# EAGLE design Power control shield v1 (EAGLE 6.1)
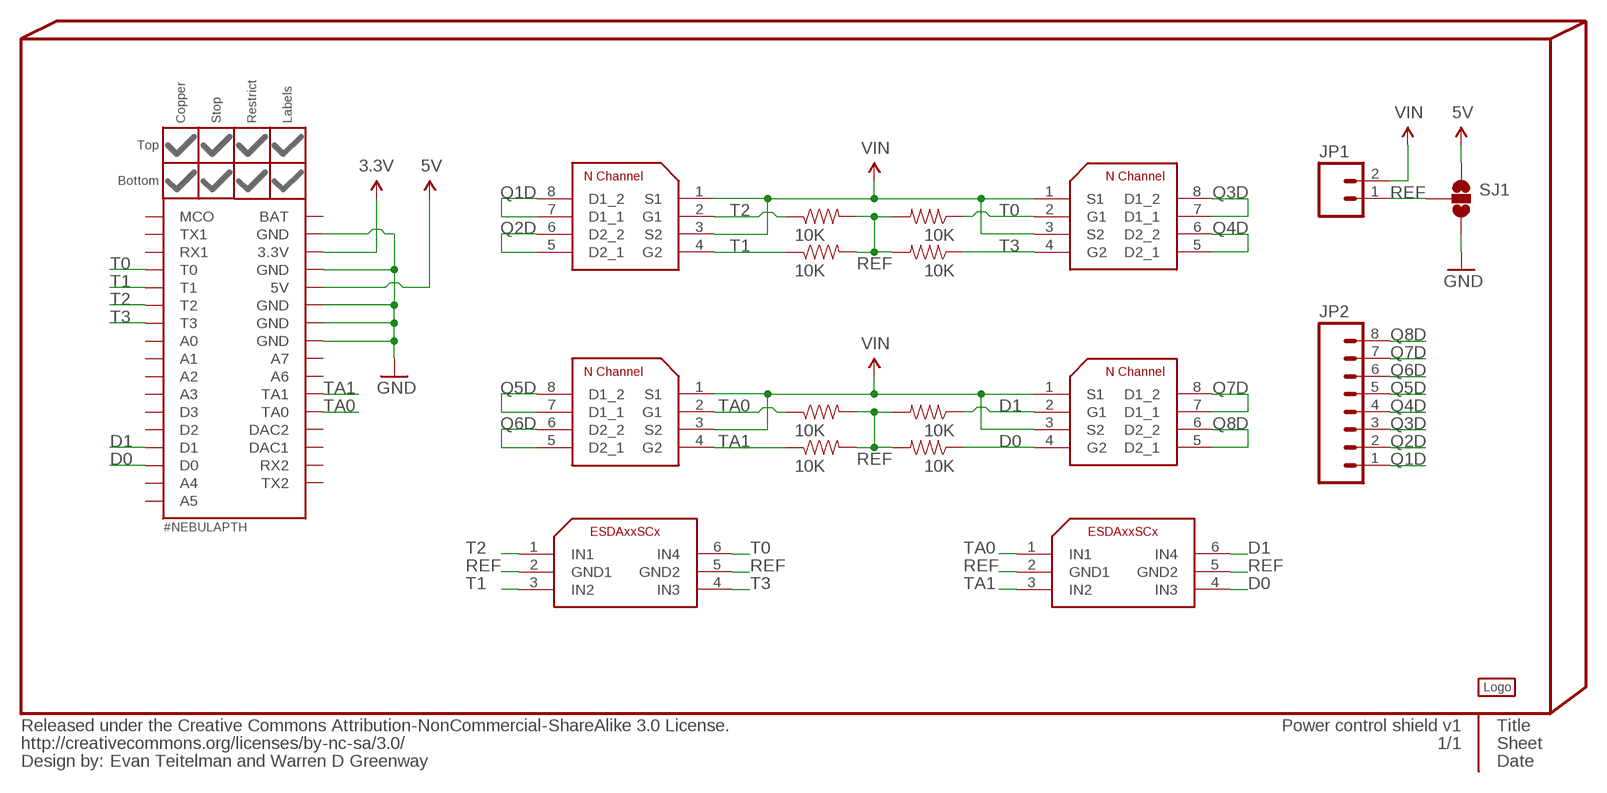
[diagram p0: schematic, sheet 1]

## Parts
INFO2  Evan Teitelman and Warren D Greenway  %CC-NC-SA  [%CC-NC-SA]
JP1  M02PTH  [1X02]
JP2  M081X08  [1X08]
LOGO1  #LOGOA-THICK  [#LOGOA-THICK]
NEBULA1  #NEBULAPTH  [#NEBULA-PTH]
NEBULAPART1  #NEBULA-PARTLABELS-BOTTOM  [#NEBULA-LABELS-BOTT]
R1  10K  RESISTOR0402-RES  [0402-RES]
R2  10K  RESISTOR0402-RES  [0402-RES]
R3  10K  RESISTOR0402-RES  [0402-RES]
R4  10K  RESISTOR0402-RES  [0402-RES]
R9  10K  RESISTOR0402-RES  [0402-RES]
R10  10K  RESISTOR0402-RES  [0402-RES]
R11  10K  RESISTOR0402-RES  [0402-RES]
R12  10K  RESISTOR0402-RES  [0402-RES]
SJ1  SOLDERJUMPER_2WAYPASTE2&3  [SJ_3_PASTE2&3]
U1  TRANSISTOR-VISHAY-SI7288DP  [SOIC8]
U2  TRANSISTOR-VISHAY-SI7288DP  [SOIC8]
U3  TRANSISTOR-VISHAY-SI7288DP  [SOIC8]
U4  TRANSISTOR-VISHAY-SI7288DP  [SOIC8]
U$1  ESDAXXSC6  [SOT23-6L]
U$3  ESDAXXSC6  [SOT23-6L]

## Nets
3.3V: NEBULA1.3.3V ; supply symbol labelled @3.3V
5V: NEBULA1.5V SJ1.1 ; supply symbol labelled @5V
D0: NEBULA1.D0 R4.1 U4.4(G2) U$3.4(IN3)
D1: NEBULA1.D1 R3.1 U4.2(G1) U$3.6(IN4)
GND: NEBULA1.GND1(GND) NEBULA1.GND2(GND) NEBULA1.GND3(GND) NEBULA1.GND4(GND) NEBULA1.GND5(GND) SJ1.3 ; supply symbol labelled @GND
Q1D: JP2.1 U1.7(D1_1) U1.8(D1_2)
Q2D: JP2.2 U1.5(D2_1) U1.6(D2_2)
Q3D: JP2.3 U2.7(D1_1) U2.8(D1_2)
Q4D: JP2.4 U2.5(D2_1) U2.6(D2_2)
Q5D: JP2.5 U3.7(D1_1) U3.8(D1_2)
Q6D: JP2.6 U3.5(D2_1) U3.6(D2_2)
Q7D: JP2.7 U4.7(D1_1) U4.8(D1_2)
Q8D: JP2.8 U4.5(D2_1) U4.6(D2_2)
REF: JP1.1 R1.2 R2.2 R3.2 R4.2 R9.2 R10.2 R11.2 R12.2 SJ1.2 U$1.2(GND1) U$1.5(GND2) U$3.2(GND1) U$3.5(GND2)
T0: NEBULA1.T0 R11.1 U2.2(G1) U$1.6(IN4)
T1: NEBULA1.T1 R10.1 U1.4(G2) U$1.3(IN2)
T2: NEBULA1.T2 R9.1 U1.2(G1) U$1.1(IN1)
T3: NEBULA1.T3 R12.1 U2.4(G2) U$1.4(IN3)
TA0: NEBULA1.TA0 R1.1 U3.2(G1) U$3.1(IN1)
TA1: NEBULA1.TA1 R2.1 U3.4(G2) U$3.3(IN2)
VIN: JP1.2 U1.1(S1) U1.3(S2) U2.1(S1) U2.3(S2) U3.1(S1) U3.3(S2) U4.1(S1) U4.3(S2) ; supply symbol labelled @VIN
Unconnected: NEBULA1.A0 NEBULA1.A1 NEBULA1.A2 NEBULA1.A3 NEBULA1.A4 NEBULA1.A5 NEBULA1.A6 NEBULA1.A7 NEBULA1.BAT NEBULA1.COM1_RX(RX1) NEBULA1.COM1_TX(TX1) NEBULA1.COM2_RX(RX2) NEBULA1.COM2_TX(TX2) NEBULA1.D2 NEBULA1.D3 NEBULA1.DAC1 NEBULA1.DAC2 NEBULA1.MCO

## Library data of the parts
INFO2 = PygmyBoards:%CC-NC-SA: Released under the Creative Commons Attribution-NonCommercial-ShareAlike 3.0 License. http://creativecommons.org/licenses/by-sa/3.0 Design by: [Designer Name] Change this part's value to change the designer name
JP1 = SparkFun:M02: Header 2 Standard 2-pin 0.1" header. Use with straight break away headers (SKU : PRT-00116), right angle break away headers (PRT-00553), swiss pins (PRT-00743), machine pins (PRT-00117), and female headers (PRT-00115). Molex polarized connector foot print use with SKU : PRT-08233 with associated crimp pins and housings.
JP2 = SparkFun:M08: Header 8 Standard 8-pin 0.1" header. Use with straight break away headers (SKU : PRT-00116), right angle break away headers (PRT-00553), swiss pins (PRT-00743), machine pins (PRT-00117), and female headers (PRT-00115).
LOGO1 = PygmyBoards:#LOGO
NEBULA1 = PygmyBoards:#NEBULA: Nebula Board and Shield Footprint Pads This is the only absolutely required part for the footprint. The parts in "#NEBULA-PART" are merely aesthetic. A circular board outline should be .001" thick and 1.005" in diameter (Reference circle on the Document (48) layer provided).
NEBULAPART1 = PygmyBoards:#NEBULA-PART: Nebula Board and Shield Footprint Parts These parts are only functional when combined with the pads in "#NEBULA".
R1-R4 R9-R12 = SparkFun:RESISTOR: Resistor Basic schematic elements and footprints for 0603, 1206, and PTH resistors.
SJ1 = SparkFun:SOLDERJUMPER_2WAY: Solder Jumper 2 way solder jumper
U1-U4 = Pygmy:TRANSISTOR-VISHAY-SI7288DP
U$1 U$3 = Pygmy:ESDAXXSC6

## Board
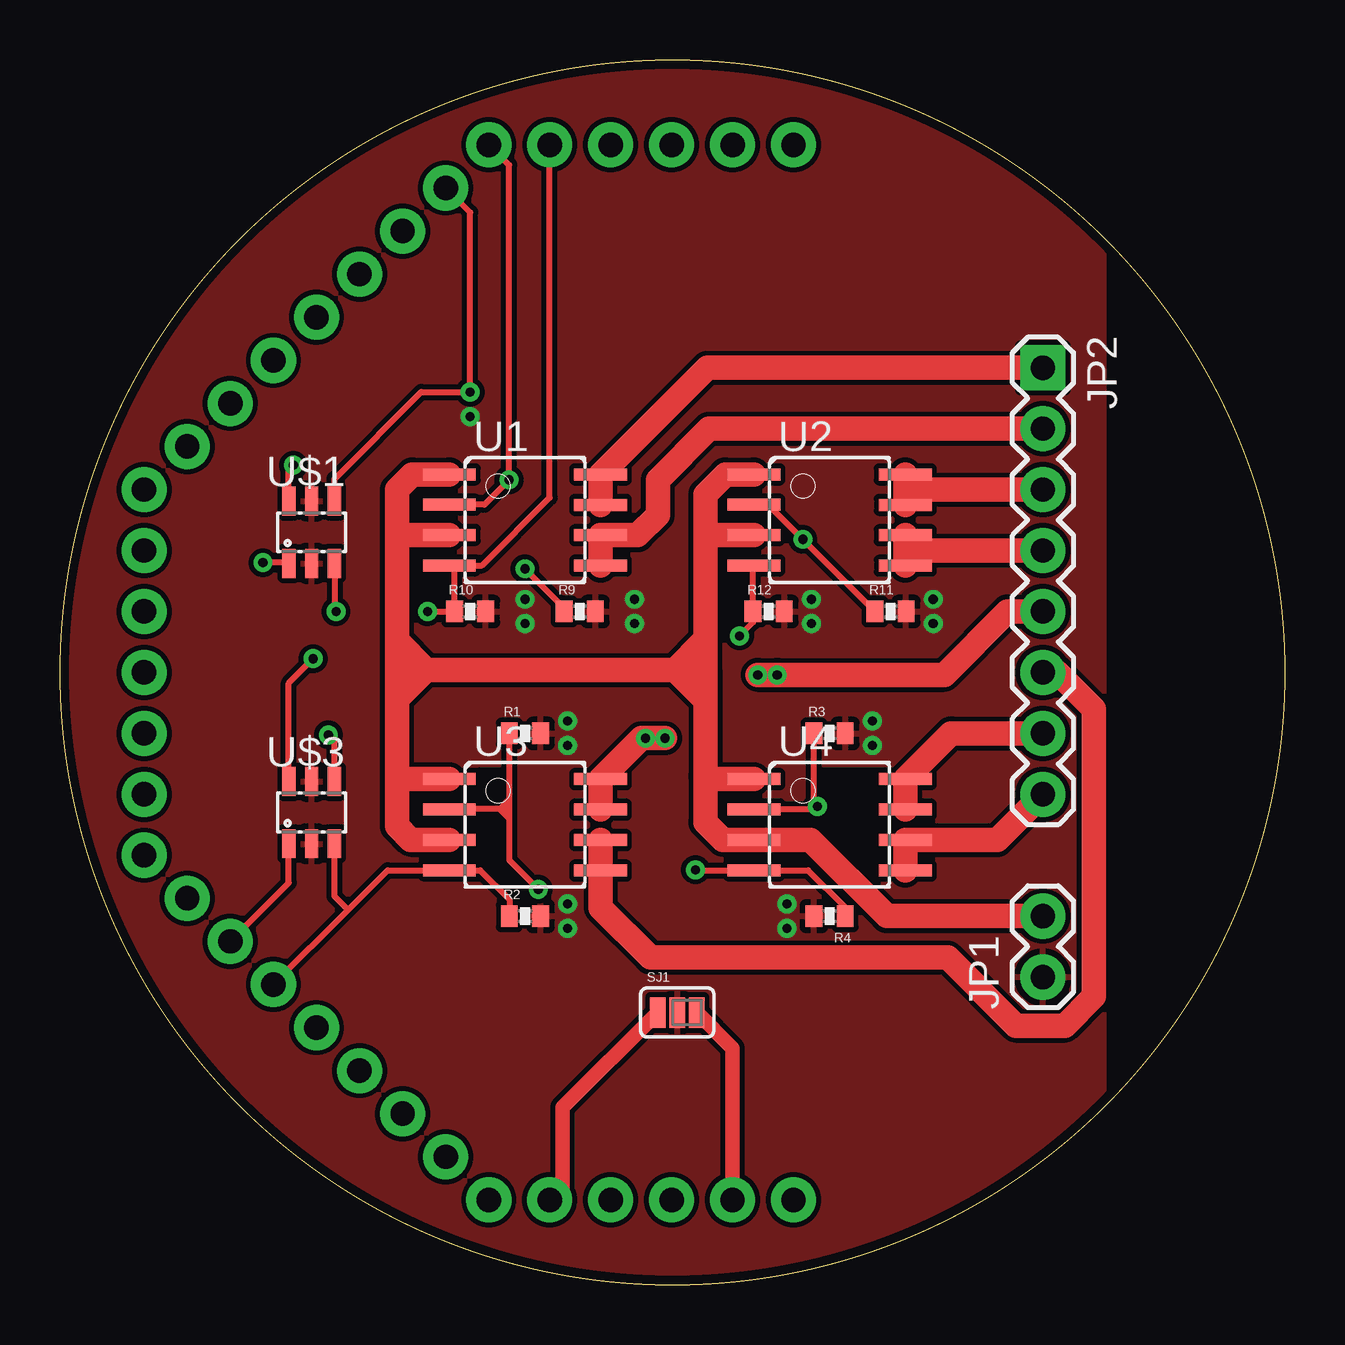
[diagram p1: board, top side]
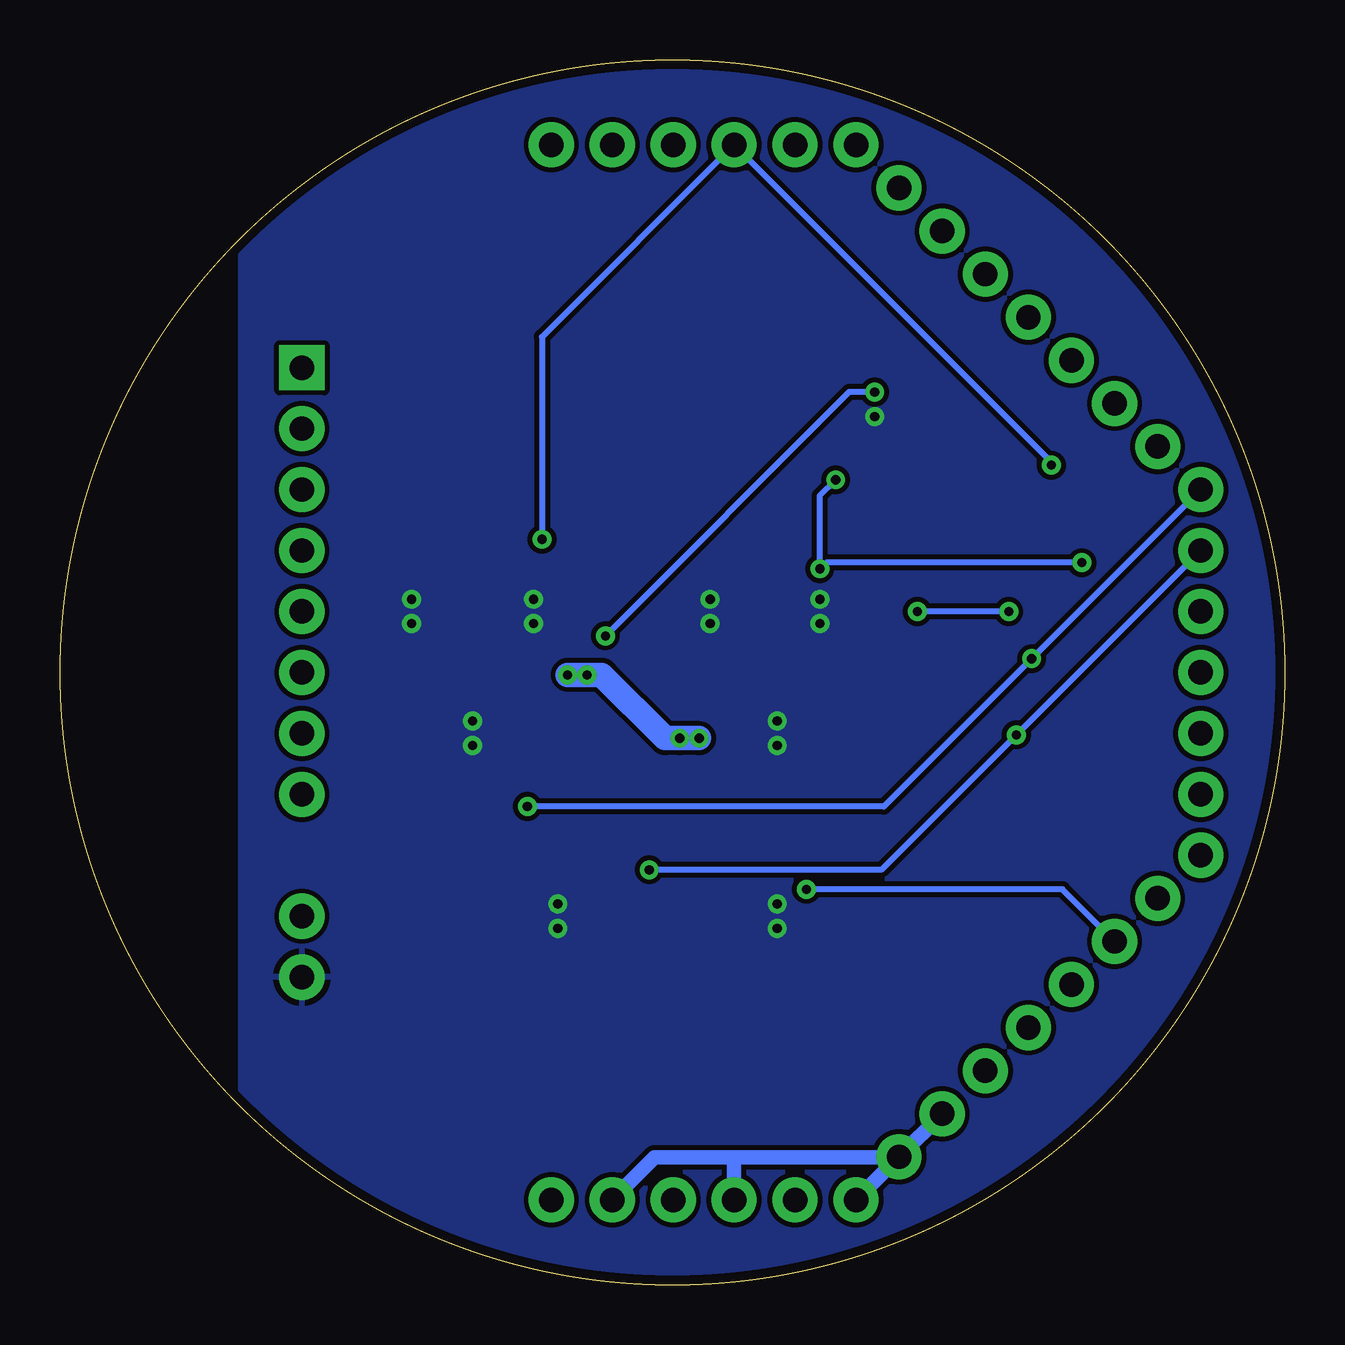
[diagram p2: board, bottom side, seen from below]

Size 51.05 x 51.05 mm. Coordinates in mm from the lower left corner, seen from the top.
Outline: circle at 25.53,25.53 radius 25.53
Copper layers (1*16): Top 0.035mm / dielectric 1.5mm / Bottom 0.035mm
Design rules: minimum track width 6mil, minimum drill 15mil, track to track 6mil, track to pad 6mil, pad to pad 4mil, via to via 6mil, smd to smd 4mil, copper to edge 15mil, drill to drill 6mil, minimum pad ring 10mil, minimum via ring 8mil, stop-mask expansion 4mil, vias tented up to drill 25mil, thermal gap 10mil
tRestrict: 2 lines

### Footprints (pad centres in the part's own frame; a part is rotated, then mirrored left to right if it is on the bottom)
1X02 = drill 1.016 pad 1.88: 1 0,0; 2 2.54,0
1X08 = drill 1.016 pad 1.88 square: 1 0,0 | drill 1.016 pad 1.88: 2 2.54,0; 3 5.08,0; 4 7.62,0; 5 10.16,0; 6 12.7,0; 7 15.24,0; 8 17.78,0
#NEBULA-PTH = drill 1.016 pad 1.88: 3.3V -25.637,-47.388; 5V -30.716,-47.388; A0 -36.848,-7.004; A1 -38.645,-8.8; A2 -40.44,-10.596; A3 -42.237,-12.392; A4 -47.625,-22.86; A5 -47.625,-25.4; A6 -40.44,-40.204; A7 -38.645,-42; BAT -20.557,-47.388; COM1_RX -25.636,-3.412; COM1_TX -23.096,-3.412; COM2_RX -47.625,-30.48; COM2_TX -47.625,-27.94; D0 -47.625,-20.32; D1 -47.625,-17.78; D2 -45.829,-15.984; D3 -44.032,-14.188; DAC1 -47.625,-33.02; DAC2 -45.829,-34.816; GND1 -36.848,-43.796; GND2 -35.052,-45.592; GND3 -33.256,-47.388; GND4 -28.177,-47.388; GND5 -23.097,-47.388; MCO -20.556,-3.412; T0 -28.176,-3.412; T1 -30.716,-3.412; T2 -33.256,-3.412; T3 -35.052,-5.208; TA0 -44.032,-36.612; TA1 -42.237,-38.408
0402-RES = smd 0.7 x 0.9: 1 -0.65,0; 2 0.65,0
SJ_3_PASTE2&3 = smd 0.635 x 1.27: 1 -0.813,0; 2 0,0; 3 0.813,0
SOIC8 = smd 0.5 x 2.2: 1 -1.905,-3.154; 2 -0.645,-3.154; 3 0.625,-3.154; 4 1.895,-3.154; 5 1.905,3.154; 6 0.635,3.154; 7 -0.635,3.154; 8 -1.905,3.154
SOT23-6L = smd 0.55 x 1.2: 1 -0.95,-1.3; 2 0,-1.3; 3 0.95,-1.3; 4 0.95,1.3; 5 0,1.3; 6 -0.95,1.3

### Placement (x,y rotation side)
INFO2  51.13,50.93 0 top
JP1  40.97,12.83 90 top
JP2  40.97,38.23 270 top
LOGO1  25.73,36.96 90 bottom
NEBULA1  51.13,50.93 0 top
NEBULAPART1  51.13,50.93 0 top
R1  19.38,22.99 0 top
R2  19.38,15.37 0 top
R3  32.08,22.99 0 top
R4  32.08,15.37 180 top
R9  21.67,28.07 0 top
R10  17.09,28.07 0 top
R11  34.62,28.07 0 top
R12  29.54,28.07 0 top
SJ1  25.73,11.35 0 top
U1  19.38,31.88 270 top
U2  32.08,31.88 270 top
U3  19.38,19.18 270 top
U4  32.08,19.18 270 top
U$1  10.49,31.37 0 top
U$3  10.49,19.68 0 top

### Tracks (layer width: path | path; a pad name or v marks a point on that pad's centre or on a via)
5V
  Top 0.61: SJ1.1 20.96,7.39 20.96,4.08 NEBULA1.5V
D0  (via drill 0.38)
  Top 0.254: v26.49,17.3 26.51,17.28 U4.4 31.18,17.28 32.73,15.73 R4.1 | U$3.4 11.44,22.67 v11.19,22.92
  Bottom 0.254: v26.49,17.3 16.82,17.3 v11.19,22.92 NEBULA1.D0
D1  (via drill 0.38)
  Top 0.254: 30.03,19.82 U4.2 31.46,19.82 v31.57,19.94 31.43,20.08 R3.1 | U$3.6 9.54,25.09 v10.55,26.1
  Bottom 0.254: v31.57,19.94 16.71,19.94 v10.55,26.1 NEBULA1.D1
GND
  Top 0.61: SJ1.3 28.03,9.86 NEBULA1.GND5
  Bottom 0.61: NEBULA1.GND1 | NEBULA1.GND2 NEBULA1.GND1 | NEBULA1.GND2 | NEBULA1.GND3 NEBULA1.GND2 | NEBULA1.GND5 26.26,5.31 22.78,5.31 | 22.78,5.31 16.1,5.31 NEBULA1.GND2 | NEBULA1.GND4 22.95,5.14 22.78,5.31
Q1D
  Top 1.016: U1.7 U1.8 26.98,38.23 JP2.1
Q2D
  Top 1.016: U1.5 U1.6 24.08,31.24 24.92,32.08 24.92,33.55 27.05,35.69 JP2.2
Q3D
  Top 1.016: U2.7 35.23,33.15 | 35.23,33.15 U2.8 | 35.23,33.15 JP2.3
Q4D
  Top 0.61: 35.23,30.71 35.34,30.61
  Top 1.016: U2.5 35.23,30.71 U2.6 | 35.34,30.61 JP2.4
Q5D  (via drill 0.38)
  Top 0.61: 24.24,22.78 v24.41,22.78
  Top 1.016: U3.7 U3.8 24.24,22.78 | JP2.5 39.5,28.07 36.86,25.43 v29.9,25.43 v29.08,25.43 | v24.41,22.78 v25.22,22.78
  Bottom 1.016: v29.9,25.43 v29.08,25.43 28.47,25.43 25.83,22.78 v25.22,22.78 v24.41,22.78
Q6D
  Top 0.61: U3.5 U3.6
  Top 1.016: U3.6 22.53,15.72 24.61,13.64 37.01,13.64 39.85,10.79 41.88,10.79 43.1,12.01 43.1,24 41.58,25.53 JP2.6
Q7D
  Top 1.016: U4.7 U4.8 37.14,22.99 JP2.7
Q8D
  Top 1.016: U4.5 U4.6 39.07,18.54 JP2.8
REF  (via drill 0.38)
  other vias: 23.95,28.57 19.38,28.57 19.38,27.56 23.95,27.56 21.16,23.5 21.16,22.48 21.16,15.88 21.16,14.86 30.3,15.88 30.3,14.86 33.86,23.5 33.86,22.48 31.32,28.57 31.32,27.56 36.4,28.57 36.4,27.56 17.09,36.19
  pour Top (isolate 0.203): -0.94,-1.14 43.51,-1.14 43.51,52.2 -0.94,52.2
  pour Bottom (isolate 0.203): -2.21,-2.41 43.51,-2.41 43.51,53.47 -2.21,53.47
T0  (via drill 0.38)
  Top 0.254: U2.2 29.5,32.54 v30.96,31.07 R11.1 | U$1.6 9.54,33.97 v9.73,34.16
  Bottom 0.254: v30.96,31.07 30.96,39.51 NEBULA1.T0 9.73,34.29 v9.73,34.16
T1  (via drill 0.38)
  Top 0.254: U1.4 16.19,29.95 | U1.4 17.59,29.98 20.41,32.81 NEBULA1.T1 | U$1.3 11.44,28.13 v11.51,28.07 | v15.32,28.07 R10.1 16.44,29.76 U1.4
  Bottom 0.254: v11.51,28.07 v15.32,28.07
T2  (via drill 0.38)
  Top 0.254: U1.2 17.69,32.52 v18.72,33.55 18.72,46.67 NEBULA1.T2 | v8.46,30.1 9.51,30.1 U$1.1 | R9.1 21.02,28.21 v19.38,29.85
  Bottom 0.254: v8.46,30.1 19.13,30.1 v19.38,29.85 19.38,32.89 v18.72,33.55
T3  (via drill 0.38)
  Top 0.254: U2.4 28.89,29.95 R12.1 28.89,27.62 v28.32,27.05 | NEBULA1.T3 17.09,44.7 v17.09,37.21 15.06,37.21 11.44,33.59 U$1.4
  Bottom 0.254: v28.32,27.05 18.16,37.21 v17.09,37.21
TA0  (via drill 0.38)
  Top 0.254: 18.73,19.84 R1.1 | U3.2 16.24,19.84 18.31,19.84 | 18.73,19.84 18.31,19.84 | 18.31,19.84 18.72,20.24 | 18.31,19.84 18.72,19.43 | 18.73,19.84 18.73,17.69 v19.94,16.48 | U$3.1 9.54,16.76 NEBULA1.TA0
  Bottom 0.254: v19.94,16.48 9.27,16.48 NEBULA1.TA0
TA1
  Top 0.254: 18.73,15.17 R2.1 18.73,16.07 17.52,17.28 U3.4 13.66,17.28 12.01,15.63 | NEBULA1.TA1 12.01,15.63 | U$3.3 11.44,16.2 12.01,15.63
VIN
  Top 0.61: U3.1 15.67,21.08 | 26.9,31.32 26.97,31.25 | 14.05,31.24 14.06,31.25 | 14.05,20.95 14.17,21.08
  Top 1.016: U4.1 27.03,21.08 26.9,21.21 | U2.1 27.74,33.78 26.9,32.94 26.9,31.32 26.9,25.63 | U3.3 14.62,18.55 14.05,19.13 14.05,20.95 14.05,24.41 | 26.97,31.25 U2.3 | JP1.2 34.47,15.37 31.28,18.55 U4.3 27.63,18.55 26.9,19.28 26.9,21.21 | 14.05,24.41 14.05,25.63 | 14.05,25.63 14.05,26.85 | 14.05,26.85 14.05,31.24 14.05,33.15 14.68,33.78 U1.1 | 14.06,31.25 U1.3 | 14.17,21.08 U3.1 | 14.05,25.63 15.27,25.63 | 26.9,25.63 26.9,21.21 | 15.27,25.63 14.05,26.85 | 14.05,24.41 15.27,25.63 | 15.27,25.63 25.63,25.63 | 25.63,25.63 26.9,25.63 | 25.63,25.63 26.85,26.85 | 25.63,25.63 26.85,24.41

### Text on the board
tTest: 1 | 2 | 3 | 4 | 5 | 6 | 7 | 8 | Ref | Vin | 5V | 0V | Ref
bTest: Version 1 | Pygmy Power Control Shield | Designed By: | Evan Teitelman | Warren D Greenway
Document: Pygmy Power Control Shield | Version 1.0 | Standard Grid: 50mil | Routing Grids: 8mil / 4mil